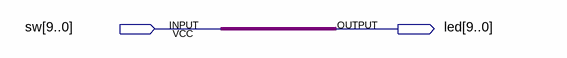
[diagram p0: schematic sheet]
// Quartus schematic HelloWorld.bdf as structural Verilog: 0 symbols, 2 pins
module HelloWorld (
  input  [9:0] sw,
  output [9:0] led
);


  assign led = sw;
endmodule
